# Altium project Sem3_Lab_Project_PCB.PrjPcb
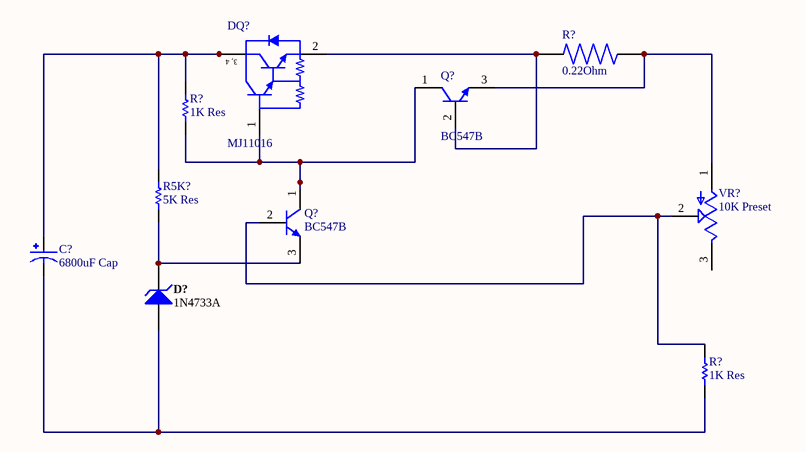
[diagram p0: Sem3_Schematics.SchDoc]
1 sheet, 10 parts. Net scope: global (net labels, ports and power ports of the same name join across sheets).
Board file: Sem3_PCB.PcbDoc

## Sheet Sem3_Schematics.SchDoc
size A; SheetNumber: 1; SheetTotal: 1

### Parts
(Parts that share a designator on the sheet are numbered #1, #2 ... from top to bottom, then left to right.)
C?  6800uF Cap  [CAPPRD500W60D1000H1600]
D?  1N4733A  [FAIR-DO-41-2_V]
DQ?  MJ11016  [ONSC-TO-204-3-1-07]
Q?#1  BC547B  [ONSC-TO-92-3-29-11]
Q?#2  BC547B  [ONSC-TO-92-3-29-11]
R5K?  5K Res  [RESA60-630X240]
R?#1  0.22Ohm  [RESRR500W80L1400T1000H4050]
R?#2  1K Res  [RESA60-630X240]
R?#3  1K Res  [RESA60-630X240]
VR?  10K Preset  [TRIM_3362P-1-102LF]

### Nets
NetC?_N: C?.N D?.1(A) R?#3.1
NetC?_P: C?.P DQ?.3(C) DQ?.4(C) R5K?.2 R?#2.2
NetD?_2: D?.2(K) Q?#2.3(E) R5K?.1
NetDQ?_1: DQ?.1(B) Q?#1.1(C) Q?#2.1(C) R?#2.1
NetDQ?_2: DQ?.2(E) Q?#1.2(B) R?#1.1
NetQ?#1_3: Q?#1.3(E) R?#1.2 VR?.1(CCW)
NetQ?#2_2: Q?#2.2(B) R?#3.2 VR?.2(WIPER)

Not connected (* = marked no-connect by the designer): VR? 3(CW)

### Notes on the sheet
- (in symbol MJ11016OS-ND) 3, 4

### Library data of the parts
C? = EEUHD1V681B: CAP ALUM 6800uF 20% 35V RADIAL; MF: Panasonic; Package: RADIAL-2 Panasonic; Availability: In Stock; Value: *; MP: EEUHD1V681B; Purchase-URL: https://pricing.snapeda.com/search/part/EEUHD1V681B/?ref=eda; Check_prices: https://www.snapeda.com/parts/EEUHD1V681B/Panasonic/view-part/5784870/?ref=eda; Price: None; SnapEDA_Link: https://www.snapeda.com/parts/EEUHD1V681B/Panasonic/view-part/5784870/?ref=snap
D? = 1727-1938-1-ND: DIODE ZENER 5.1V 1W DO41; Manufacturer: Fairchild Semiconductor; VZ (Max.) (V): 5.355; VZ (Min.) (V): 4.845; Test Current IZ (mA): 49; IR (uA): 10; PD (W): 1; ZZ (Max) (ohm): 7; Tolerance: 5%; PackageVersion: Rev. 2; Operating and Storage Temperature Range: -65 to 200 degC; ComponentLink3URL: http://www.fairchildsemi.com/dwg/DO/DO41A.pdf; ComponentLink1URL: http://www.fairchildsemi.com/; PackageDescription: 2-Pin Axial leaded, Body 2.72 x 5.2 mm, Lead Spread 25.4 mm; PartNumber: 1N4733A; ComponentLink2Description: Datasheet; RoHS: TRUE; ComponentLink3Description: Package Specification; ComponentLink2URL: http://www.fairchildsemi.com/ds/1N/1N4744A.pdf; ComponentLink1Description: Manufacturer URL; PackageReference: DO-41-2; DatasheetVersion: Rev. H3; Mounting Technology: Through Hole
DQ? = MJ11016OS-ND: TRANS NPN DARL 120V 30A TO3; Manufacturer: On Semiconductor; IC Continuous (A): 30; Packing: Tray; PackageVersion: Rev. Z, 05/1988; Polarity: NPN; DatasheetVersion: Rev. 5; ComponentLink1URL: http://www.onsemi.com/; PartNumber: MJ11016; ComponentLink1Description: Manufacturer URL; PackageDescription: 2-Pin Transistor Outline, Body 39.37 x 26.67 mm, Pitch 10.92 mm; RoHS: FALSE; ComponentLink3URL: http://www.onsemi.com/pub_link/Collateral/1-07.PDF; PackageReference: TO-204-3-1-07; ComponentLink2URL: http://www.onsemi.com/pub_link/Collateral/MJ11012-D.PDF; ComponentLink2Description: Datasheet; ComponentLink3Description: Package Specification; Mounting Technology: Through Hole
Q?#1 Q?#2 = ONSC-NPN-C1B2E3-3: Amplifier Transistor, NPN Silicon, 3-Pin TO-92, Bulk Box; Manufacturer: On Semiconductor; IC Continuous (A): 0.1; fT Min (MHz): 150; DatasheetVersion: Rev. 7; ComponentLink1URL: http://www.onsemi.com/; Polarity: NPN; RoHS: FALSE; ComponentLink1Description: Manufacturer URL; Packing: Bulk Box; PackageDescription: 3-Pin Transistor Outline, Body 4.825 x 3.685 mm, Pitch 1.27 mm; ComponentLink3URL: http://www.onsemi.cn/pub_link/Collateral/2N6426-D.PDF; ComponentLink2Description: Datasheet; PackageVersion: Rev. AM; PackageReference: TO-92-3-29-11_AM_SL; ComponentLink3Description: Package Specification; Mounting Technology: Through Hole; PartNumber: BC547B; ComponentLink2URL: http://www.onsemi.com/pub_link/Collateral/BC546-D.PDF
R5K? = 53J5K0E-ND: RES 5K OHM 5% 3W AXIAL; Tolerance: 1%; Voltage Rating: 250 V; Resistance: 10 kohm; Power Rating: 250 mW; ComponentLink2Description: Datasheet; RoHSCompliant: true; PackageReference: MFR-25; Case\Package: Axial; Max Operating Temperature: 155 degC; DatasheetVersion: Apr-13; ComponentLink1URL: http://www.yageo.com/; Length: 0.248 inch; ComponentLink2URL: http://www.yageo.com/documents/recent/Yageo%20LR_MFR_2013.pdf; Packaging: Bulk; Package Quantity: 200; PackageDescription: 2-Pin Axial Lead, Dia 2.4 mm, Body Length 6.3 mm; Min Operating Temperature: -55 degC; ComponentLink1Description: Manufacturer URL
R?#1 = SQM700JB-0R22-ND: RES 0.22 OHM 5% 7W RADIAL; MP: SQMR733KJ; Package: None; Price: None; Value: *; Availability: Unavailable
R?#2 R?#3 = BC3238CT-ND: RES 1K OHM 0.4W 1% AXIAL; Voltage Rating: 250 V; Resistance: 10 kohm; Power Rating: 250 mW; ComponentLink2Description: Datasheet; RoHSCompliant: true; PackageReference: MFR-25; Case\Package: Axial; Max Operating Temperature: 155 degC; DatasheetVersion: Apr-13; Tolerance: 1%; ComponentLink1URL: http://www.yageo.com/; Length: 0.248 inch; ComponentLink2URL: http://www.yageo.com/documents/recent/Yageo%20LR_MFR_2013.pdf; Packaging: Bulk; Package Quantity: 200; PackageDescription: 2-Pin Axial Lead, Dia 2.4 mm, Body Length 6.3 mm; Min Operating Temperature: -55 degC; ComponentLink1Description: Manufacturer URL
VR? = 478-601030-ND: 10 kOhms 0.1W, 1/10W PC Pins Through Hole Trimmer Potentiometer Carbon 1.0 Turn Top Adjustment; MF: Bourns; MP: 3362P-1-102LF; Value: *; Purchase-URL: https://pricing.snapeda.com/search/part/3362P-1-102LF/?ref=eda; Price: None; Check_prices: https://www.snapeda.com/parts/3362P-1-102LF/Bourns/view-part/468358/?ref=eda; SnapEDA_Link: https://www.snapeda.com/parts/3362P-1-102LF/Bourns/view-part/468358/?ref=snap; Availability: Warning; Package: 3116 Bourns